# EAGLE design CCM_0020_receiver (EAGLE 9.4.2)

## Sheet 1 of 2: receiver
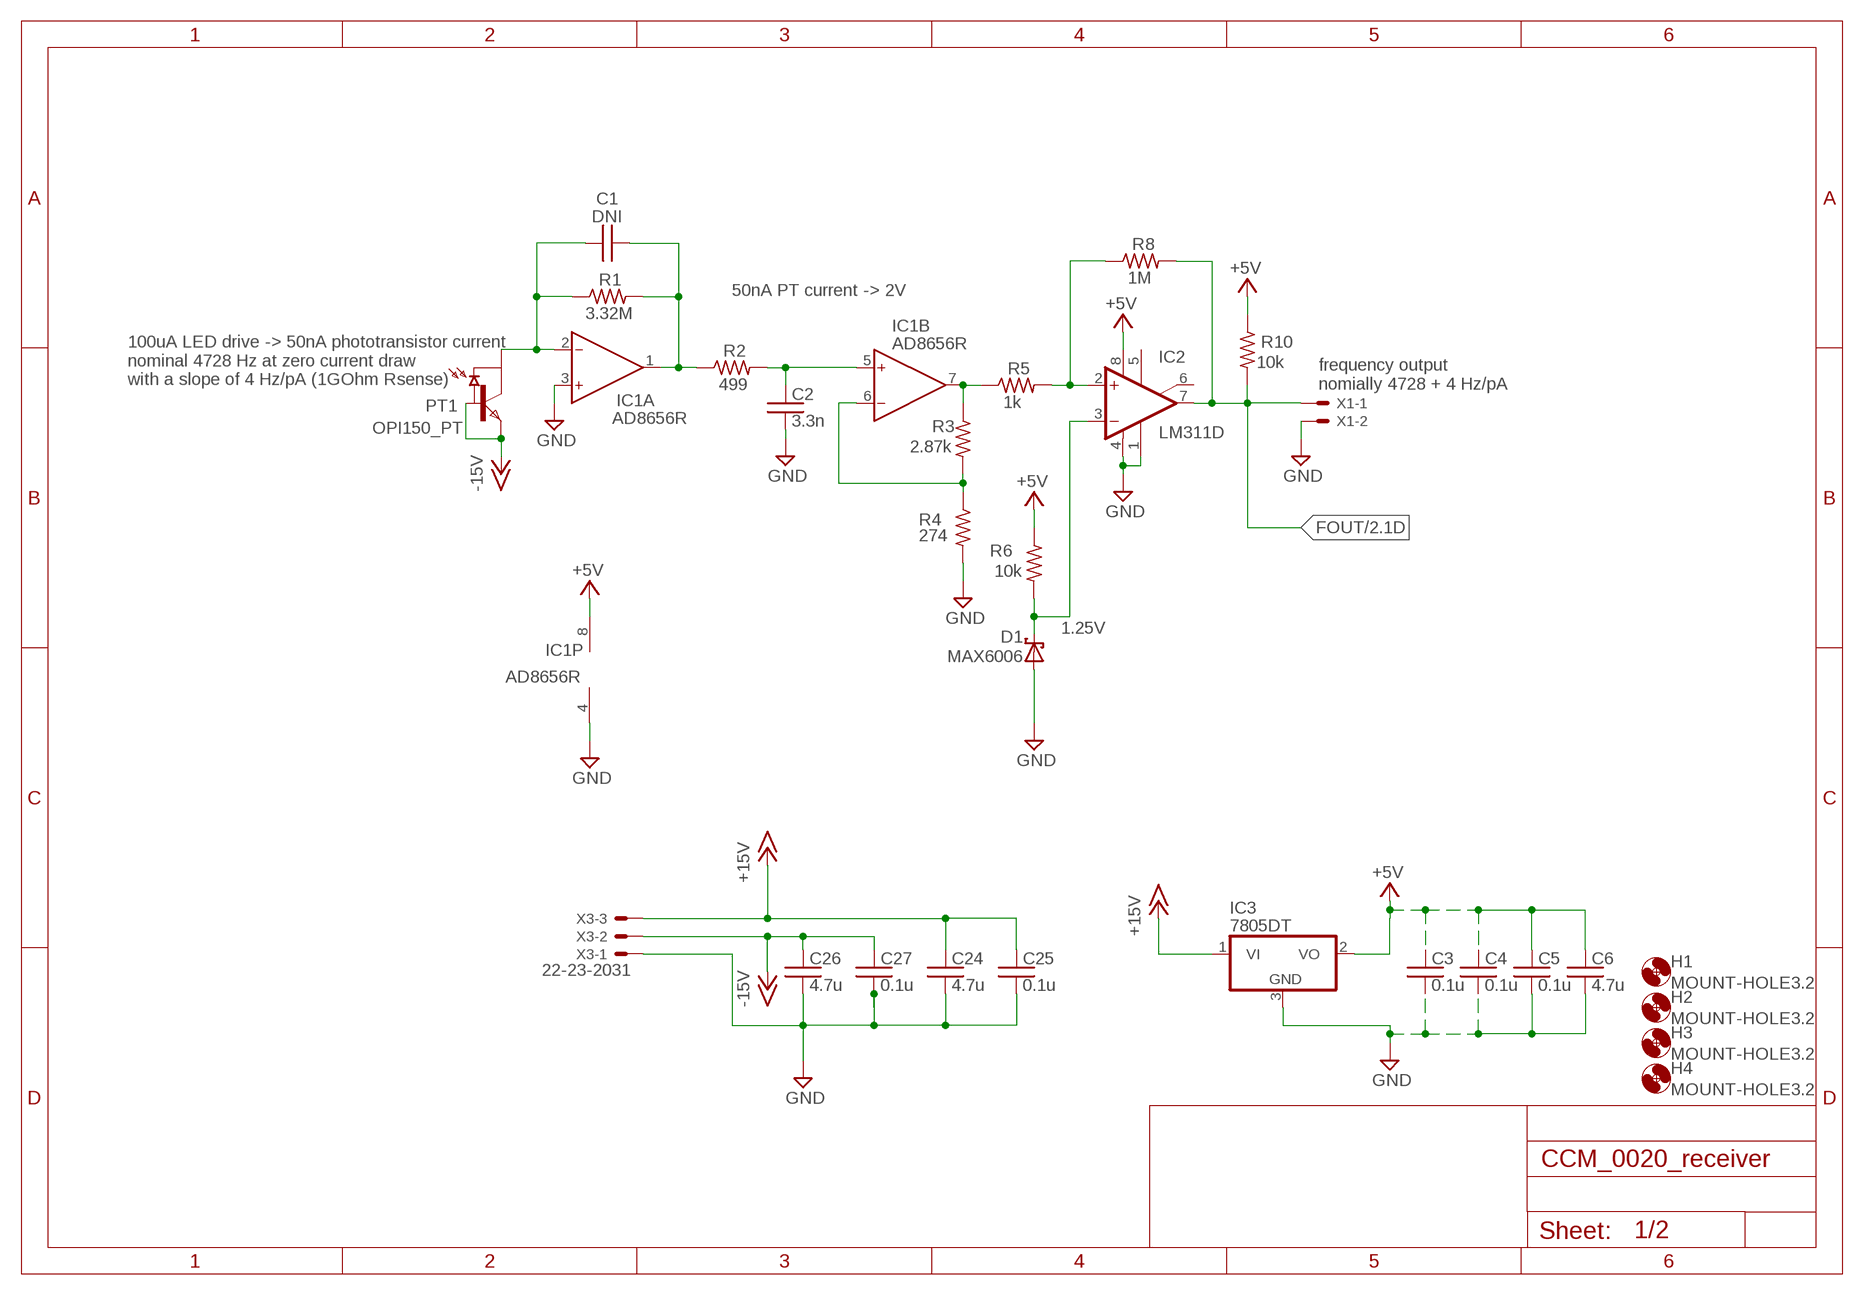
[diagram p0: schematic, sheet 1]

### Parts
C1  DNI  C0603  [0603]
C2  3.3n  C0603  [0603]
C3  0.1u  C0603  [0603]
C4  0.1u  C0603  [0603]
C5  0.1u  C0603  [0603]
C6  4.7u  C0603  [0603]
C24  4.7u  C0603  [0603]
C25  0.1u  C0603  [0603]
C26  4.7u  C0603  [0603]
C27  0.1u  C0603  [0603]
D1  MAX6006  LM4040  [SOT23]
H1  MOUNT-HOLE3.2  [3,2]
H2  MOUNT-HOLE3.2  [3,2]
H3  MOUNT-HOLE3.2  [3,2]
H4  MOUNT-HOLE3.2  [3,2]
IC1  AD8656R  [SO8]
IC2  LM311D  [SO08]
IC3  7805DT  [TO252]
PT1  OPI150_PT  OPI150_PHOTOTRANSISTOR  [OPI150_PHOTOTRANSISTOR]
R1  3.32M  R0603  [0603]
R2  499  R0603  [0603]
R3  2.87k  R0603  [0603]
R4  274  R0603  [0603]
R5  1k  R0603  [0603]
R6  10k  R0603  [0603]
R8  1M  R0603  [0603]
R10  10k  R0603  [0603]
X1  22-23-2021  [22-23-2021]
X3  22-23-2031  [22-23-2031]

### Nets
+15V: C24.1 C25.1 IC3.1(VI) X3.3 ; also sheet 2
-15V: C26.1 C27.1 PT1.P4(BASE) PT1.P5(EMITTER) X3.2 ; also sheet 2
FOUT: IC2.7(OUT) R8.2 R10.2 X1.1 ; also sheet 2
GND: C2.2 C3.2 C4.2 C5.2 C6.2 C24.2 C25.2 C26.2 C27.2 D1.2(A) IC1.3(A:IN+) IC1.4(P:V-) IC2.1(GND) IC2.4(V-) IC3.3(GND) R4.2 X1.2 X3.1 ; also sheet 2
N$2: C1.1 IC1.2(A:IN-) PT1.P3(COLLECTOR) R1.1
N$3: C2.1 IC1.5(B:IN+) R2.2
N$4: C1.2 IC1.1(A:OUT) R1.2 R2.1
N$5: IC1.6(B:IN-) R3.2 R4.1
N$6: IC1.7(B:OUT) R3.1 R5.1
N$8: IC2.2(+IN) R5.2 R8.1
N$14: D1.1(C) IC2.3(-IN) R6.2
VCC: C3.1 C4.1 C5.1 C6.1 IC1.8(P:V+) IC2.8(V+) IC3.2(VO) R6.1 R10.1 ; supply symbol labelled +5V ; also sheet 2
Unconnected: IC2.5(ON) IC2.6(ON/STR)

### Notes on the sheet
- 50nA PT current -> 2V
- 100uA LED drive -> 50nA phototransistor current
  nominal 4728 Hz at zero current draw
  with a slope of 4 Hz/pA (1GOhm Rsense)
- frequency output
  nomially 4728 + 4 Hz/pA
- 1.25V

## Sheet 2 of 2: frequency to voltage
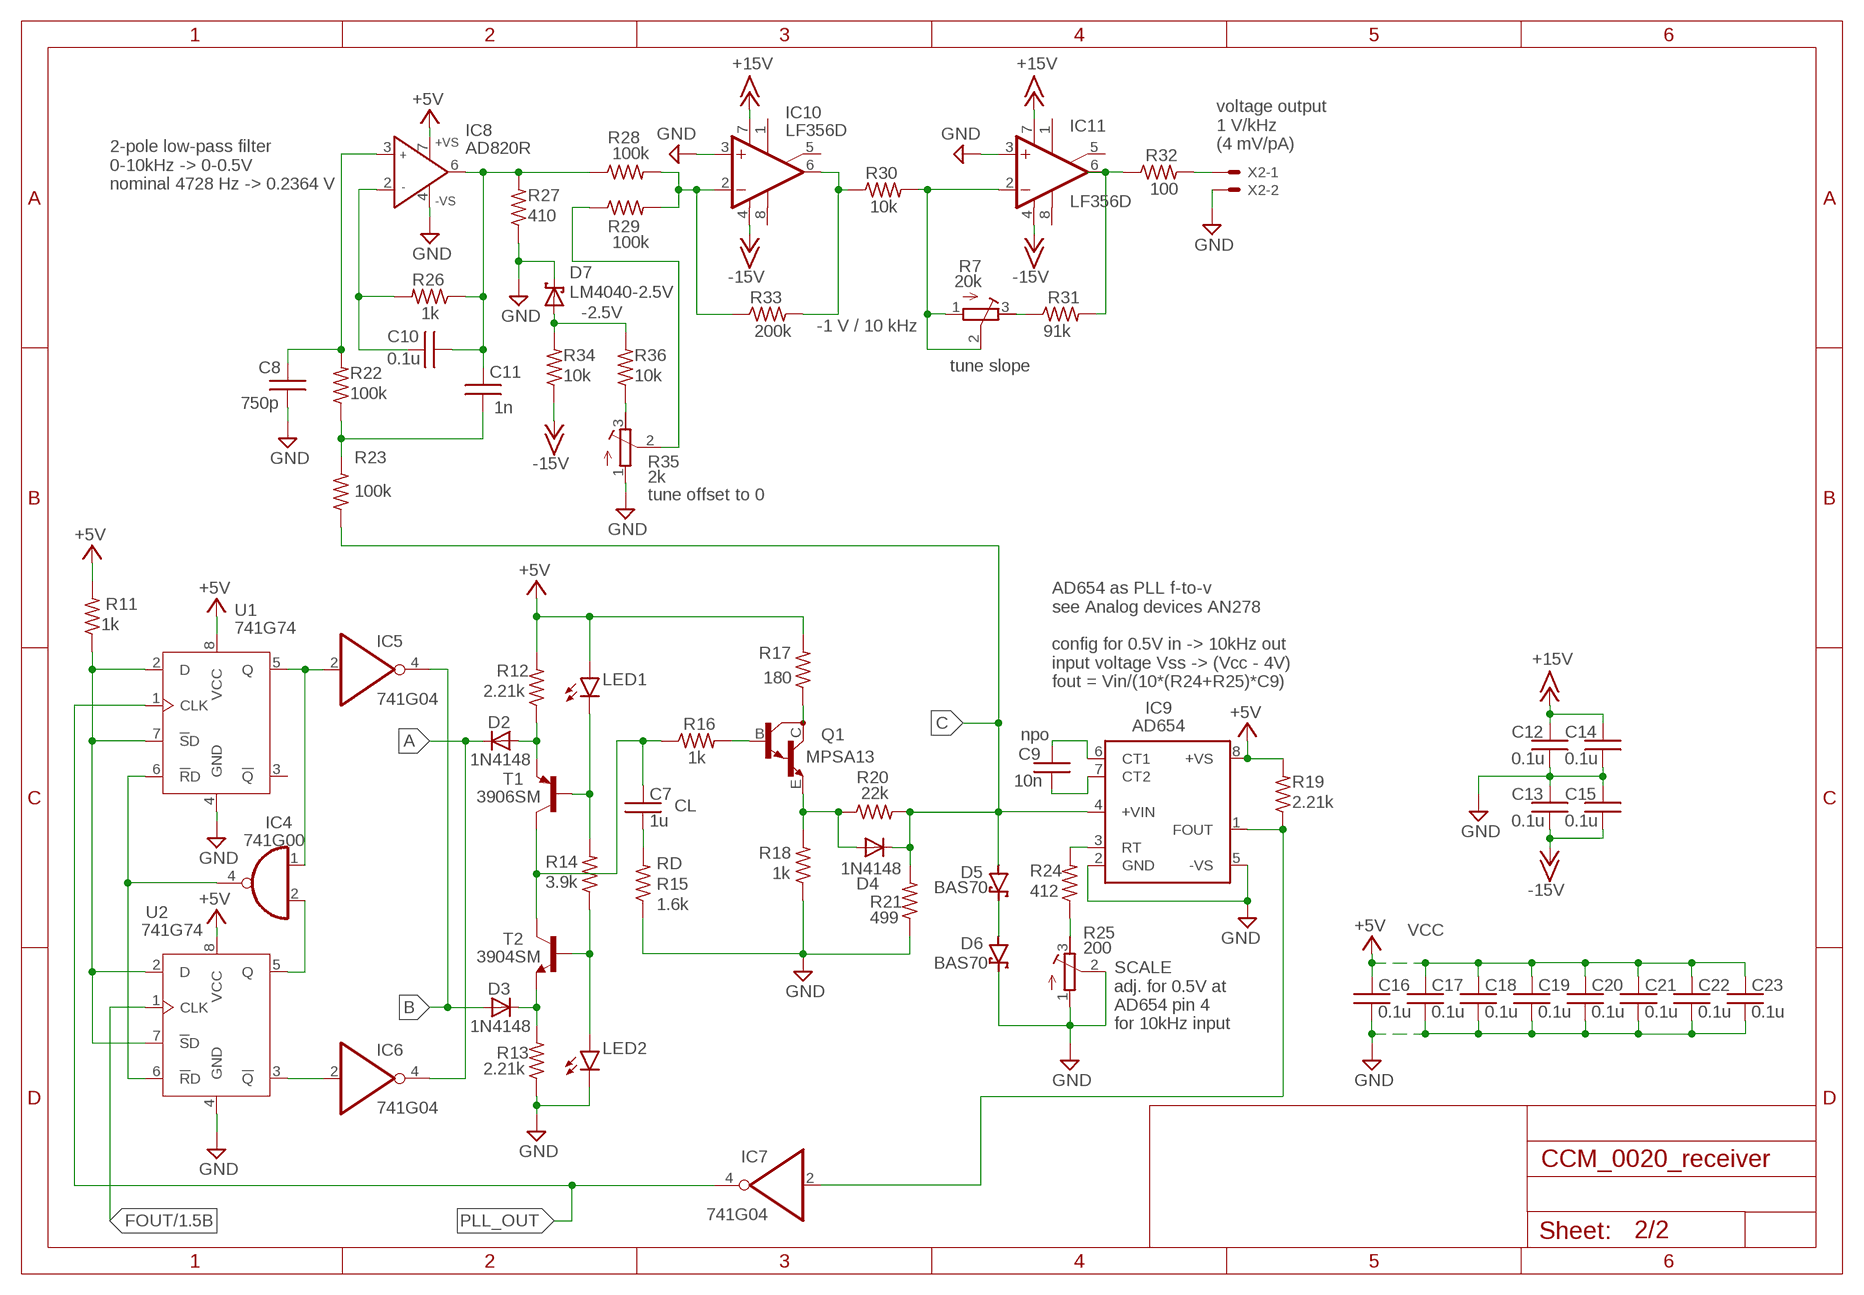
[diagram p1: schematic, sheet 2]

### Parts
C7  1u  C0603  [0603]
C8  750p  C0603  [0603]
C9  10n  C0603  [0603]
C10  0.1u  C0603  [0603]
C11  1n  C0603  [0603]
C12  0.1u  C0603  [0603]
C13  0.1u  C0603  [0603]
C14  0.1u  C0603  [0603]
C15  0.1u  C0603  [0603]
C16  0.1u  C0603  [0603]
C17  0.1u  C0603  [0603]
C18  0.1u  C0603  [0603]
C19  0.1u  C0603  [0603]
C20  0.1u  C0603  [0603]
C21  0.1u  C0603  [0603]
C22  0.1u  C0603  [0603]
C23  0.1u  C0603  [0603]
D2  1N4148  [SOD323_ST]
D3  1N4148  [SOD323_ST]
D4  1N4148  [SOD323_ST]
D5  BAS70  [SOT23]
D6  BAS70  [SOT23]
D7  LM4040-2.5V  LM4040  [SOT23]
IC4  741G00  74AHC1G00DBV  [SOT23-5]
IC5  741G04  74AHC1G04DBV  [SOT23-5]
IC6  741G04  74AHC1G04DBV  [SOT23-5]
IC7  741G04  74AHC1G04DBV  [SOT23-5]
IC8  AD820R  [SO8]
IC9  AD654  [SO08]
IC10  LF356D  [SO08]
IC11  LF356D  [SO08]
LED1  LEDCHIP-LED0603  [CHIP-LED0603]
LED2  LEDCHIP-LED0603  [CHIP-LED0603]
Q1  MPSA13  MMBTA13LT1  [SOT23-BEC]
R7  20k  R-TRIMM64Y  [RTRIM64Y]
R11  1k  R0603  [0603]
R12  2.21k  R0603  [0603]
R13  2.21k  R0603  [0603]
R14  3.9k  R0603  [0603]
R15  1.6k  R0603  [0603]
R16  1k  R0603  [0603]
R17  180  R0603  [0603]
R18  1k  R0603  [0603]
R19  2.21k  R0603  [0603]
R20  22k  R0603  [0603]
R21  499  R0603  [0603]
R22  100k  R0603  [0603]
R23  100k  R0603  [0603]
R24  412  R0603  [0603]
R25  200  R-TRIMM64Y  [RTRIM64Y]
R26  1k  R0603  [0603]
R27  410  R0603  [0603]
R28  100k  R0603  [0603]
R29  100k  R0603  [0603]
R30  10k  R0603  [0603]
R31  91k  R0603  [0603]
R32  100  R0603  [0603]
R33  200k  R0603  [0603]
R34  10k  R0603  [0603]
R35  2k  R-TRIMM64Y  [RTRIM64Y]
R36  10k  R0603  [0603]
T1  3906SM  MMBT3906LT1-PNP-SOT23-BEC  [SOT23-BEC]
T2  3904SM  [SOT23]
U1  741G74  [TSSOP8]
U2  741G74  [TSSOP8]
X2  22-23-2021  [22-23-2021]

### Nets
+15V: C12.2 C14.2 IC10.7(V+) IC11.7(V+) ; also sheet 1
-15V: C13.1 C15.1 IC10.4(V-) IC11.4(V-) R34.1 ; also sheet 1
A: D2.C IC6.4(O)
B: D3.A IC5.4(O)
C: D4.C D5.1(A) IC9.4(+VIN) R20.2 R21.2 R23.1
FOUT: U2.1(CLK) ; also sheet 1
GND: C8.1 C12.1 C13.2 C14.1 C15.2 C16.2 C17.2 C18.2 C19.2 C20.2 C21.2 C22.2 C23.2 D6.3(C) D7.1(C) IC8.4(-VS) IC9.2(GND) IC9.5(-VS) IC10.3(+IN) IC11.3(+IN) LED2.C R13.1 R15.1 R18.1 R21.1 R25.1(A) R25.2(S) R27.1 R35.1(A) U1.4(GND) U2.4(GND) X2.2 ; also sheet 1
N$1: C9.1 IC9.6(CT1)
N$7: IC4.4(O) U1.6(!R!D) U2.6(!R!D)
N$9: R7.3(E) R31.1
N$10: IC4.2(I1) U2.5(Q)
N$11: R11.1 U1.2(D) U1.7(!S!D) U2.2(D) U2.7(!S!D)
N$12: IC6.2(I) U2.3(!Q)
N$13: C11.1 R22.1 R23.2
N$15: IC4.1(I0) IC5.2(I) U1.5(Q)
N$16: C8.2 IC8.3(IN+) R22.2
N$17: C9.2 IC9.7(CT2)
N$18: R24.1 R25.3(E)
N$19: D5.3(C) D6.1(A)
N$20: C7.1 R16.1 T1.C T2.3(C)
N$21: D3.C R13.2 T2.2(E)
N$23: LED1.C R14.2 T1.B
N$24: LED2.A R14.1 T2.1(B)
N$25: C7.2 R15.2
N$26: Q1.C R17.1
N$27: Q1.B R16.2
N$28: D4.A Q1.E R18.2 R20.1
N$29: IC9.3(RT) R24.2
N$30: IC7.2(I) IC9.1(FOUT) R19.1
N$31: C10.2 C11.2 IC8.6(OUT) R26.1 R27.2 R28.1
N$32: C10.1 IC8.2(IN-) R26.2
N$33: IC10.2(-IN) R28.2 R29.2 R33.1
N$34: IC11.6(OUT) R31.2 R32.1
N$35: IC11.2(-IN) R7.1(A) R7.2(S) R30.2
N$36: R32.2 X2.1
N$37: IC10.6(OUT) R30.1 R33.2
N$38: D7.2(A) R34.2 R36.2
N$39: R29.1 R35.2(S)
N$40: R35.3(E) R36.1
N$41: D2.A R12.1 T1.E
PLL_OUT: IC7.4(O) U1.1(CLK)
VCC: C16.1 C17.1 C18.1 C19.1 C20.1 C21.1 C22.1 C23.1 IC8.7(+VS) IC9.8(+VS) LED1.A R11.2 R12.2 R17.2 R19.2 U1.8(VCC) U2.8(VCC) ; supply symbol labelled +5V ; also sheet 1
Unconnected: IC10.1(ON1) IC10.5(ON2) IC10.8(OPT) IC11.1(ON1) IC11.5(ON2) IC11.8(OPT) U1.3(!Q)

### Notes on the sheet
- voltage output
  1 V/kHz
  (4 mV/pA)
- 2-pole low-pass filter
  0-10kHz -> 0-0.5V
  nominal 4728 Hz -> 0.2364 V
- -2.5V
- -1 V / 10 kHz
- tune slope
- tune offset to 0
- AD654 as PLL f-to-v
  see Analog devices AN278
  
  config for 0.5V in -> 10kHz out
  input voltage Vss -> (Vcc - 4V)
  fout = Vin/(10*(R24+R25)*C9)
- npo
- CL
- RD
- SCALE
  adj. for 0.5V at 
  AD654 pin 4
  for 10kHz input

## Power pins joined to a net without a drawn wire
GND: IC4.3(GND) IC5.3(GND) IC6.3(GND) IC7.3(GND)
VCC: IC4.5(VCC) IC5.5(VCC) IC6.5(VCC) IC7.5(VCC)

## Library data of the parts
C1-C27 = acrooptics:C: Capacitor
D1 D7 = noah:LM4040: LM4040 Reference Zener Diode
D2-D4 = custom_parts:1N4148: DIODE high speed (Philips)
D5 D6 = diode:BAS70: Silicon Schottky Diodes General-purpose diode for high-speed switching
H1-H4 = holes:MOUNT-HOLE: MOUNTING HOLE with drill center marker
IC1 = analog-devices:AD8656: Low Noise, Precision CMOS Amplifier Source: http://www.analog.com/static/imported-files/data_sheets/AD8655_8656.pdf; MPN: AD8656ARZ; OC_FARNELL: 1117887; OC_NEWARK: 19M0993
IC2 = linear:LM311: COMPARATOR
IC3 = linear:78*: Positive VOLTAGE REGULATOR Source: http://cache.national.com/ds/LM/LM78L05.pdf http://www.fairchildsemi.com/ds/LM/LM7805.pdf
IC4 = 74xx-little-de:74*1G00: 2-input NAND gate
IC5-IC7 = 74xx-little-de:74*1G04: INVERTER Gate
IC8 = analog-devices:AD820: Single-Supply, Rail-to-Rail, Low Power, FET Input Op Amp Source: http://www.analog.com/static/imported-files/data_sheets/AD820.pdf; OC_FARNELL: 1838867; OC_NEWARK: unknown
IC9 = noah:AD654: Low Cost Monolithic Voltage-to-Frequency Converter
IC10 IC11 = linear:LF356: OP AMP
LED1 LED2 = led:LED: LED OSRAM: - CHIPLED LG R971, LG N971, LY N971, LG Q971, LY Q971, LO R971, LY R971 LH N974, LH R974 LS Q976, LO Q976, LY Q976 LO Q996 - Hyper CHIPLED LW Q18S LB Q993, LB Q99A, LB R99A - SideLED LS A670, LO A670, LY A670, LG A670, LP A670 LB A673, LV A673, LT A673, LW A673 LH A674 LY A675 LS A676, LA A676, LO A676, LY A676, LW A676 LS A679, LY A679, LG A679 - Hyper Micro SIDELED® LS Y876, LA Y876, LO Y876, LY Y876 LT Y87S - SmartLED LW L88C, LW L88S LB L89C, LB L89S, LG L890 LS L89K, LO L89K, LY L89K LS L896, LA L896, LO L896, LY L896 - TOPLED LS T670, LO T670, LY T670, LG T670, LP T670 LSG T670, LSP T670, LSY T670, LOP T670, LYG T670 LG T671, LOG T671, LSG T671 LB T673, LV T673, LT T673, LW T673 LH T674 LS T676, LA T676, LO T676, LY T676, LB T676, LH T676, LSB T676, LW T676 LB T67C, LV T67C, LT T67C, LS T67K, LO T67K, LY T67K, LW E67C LS E67B, LA E67B, LO E67B, LY E67B, LB E67C, LV E67C, LT E67C LW T67C LS T679, LY T679, LG T679 LS T770, LO T770, LY T770, LG T770, LP T770 LB T773, LV T773, LT T773, LW T773 LH T774 LS E675, LA E675, LY E675, LS T675 LS T776, LA T776, LO T776, LY T776, LB T776 LHGB T686 LT T68C, LB T68C - Hyper Mini TOPLED® LB M676 - Mini TOPLED Santana® LG M470 LS M47K, LO M47K, LY M47K Source: http://www.osram.convergy.de LUXEON: - LUMILED® LXK2-PW12-R00, LXK2-PW12-S00, LXK2-PW14-U00, LXK2-PW14-V00 LXK2-PM12-R00, LXK2-PM12-S00, LXK2-PM14-U00 LXK2-PE12-Q00, LXK2-PE12-R00, LXK2-PE12-S00, LXK2-PE14-T00, LXK2-PE14-U00 LXK2-PB12-K00, LXK2-PB12-L00, LXK2-PB12-M00, LXK2-PB14-N00, LXK2-PB14-P00, LXK2-PB14-Q00 LXK2-PR12-L00, LXK2-PR12-M00, LXK2-PR14-Q00, LXK2-PR14-R00 LXK2-PD12-Q00, LXK2-PD12-R00, LXK2-PD12-S00 LXK2-PH12-R00, LXK2-PH12-S00 LXK2-PL12-P00, LXK2-PL12-Q00, LXK2-PL12-R00 Source: www.luxeon.com KINGBRIGHT: KA-3528ASYC Source: www.kingbright.com
PT1 = noah:OPI150_PHOTOTRANSISTOR
Q1 = transistor-npn:MMBTA13*: NPN Darlington Transistor
R1-R6 R8 R10-R24 R26-R34 R36 = acrooptics:R: 0603 resistor
R7 R25 R35 = rcl:R-TRIMM: Trimm resistor; SPICEMODEL: X; SPICEPREFIXL: POT
T1 = transistor:*-PNP-: PNP Transistror
T2 = noah:3904: NPN TRANSISTOR
U1 U2 = noah:74*1G74
X1 X2 = con-molex:22-23-2021: .100" (2.54mm) Center Header - 2 Pin; MF: MOLEX; MPN: 22-23-2021; OC_FARNELL: 1462926; OC_NEWARK: 25C3832
X3 = con-molex:22-23-2031: .100" (2.54mm) Center Header - 3 Pin; MF: MOLEX; MPN: 22-23-2031; OC_FARNELL: 1462950; OC_NEWARK: 30C0862

## Net classes
1 standard: width 0.61 mm, clearance 0.254 mm

## Board
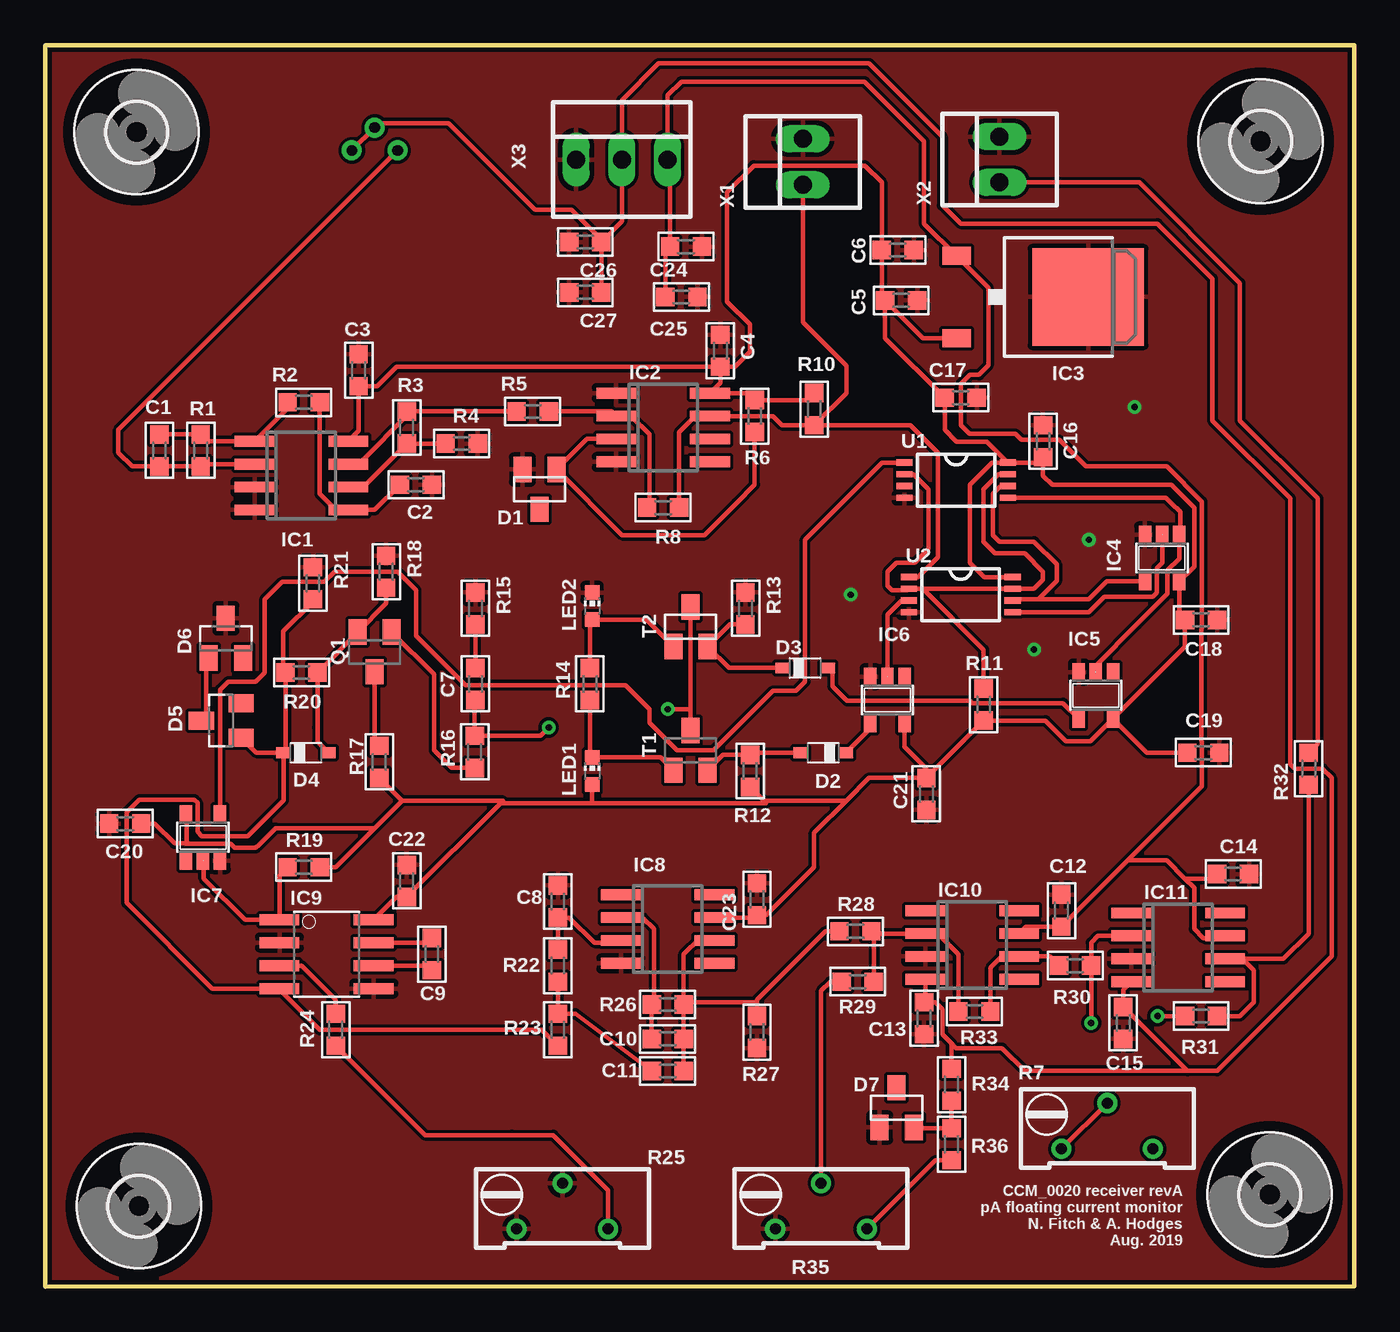
[diagram p2: board, top side]
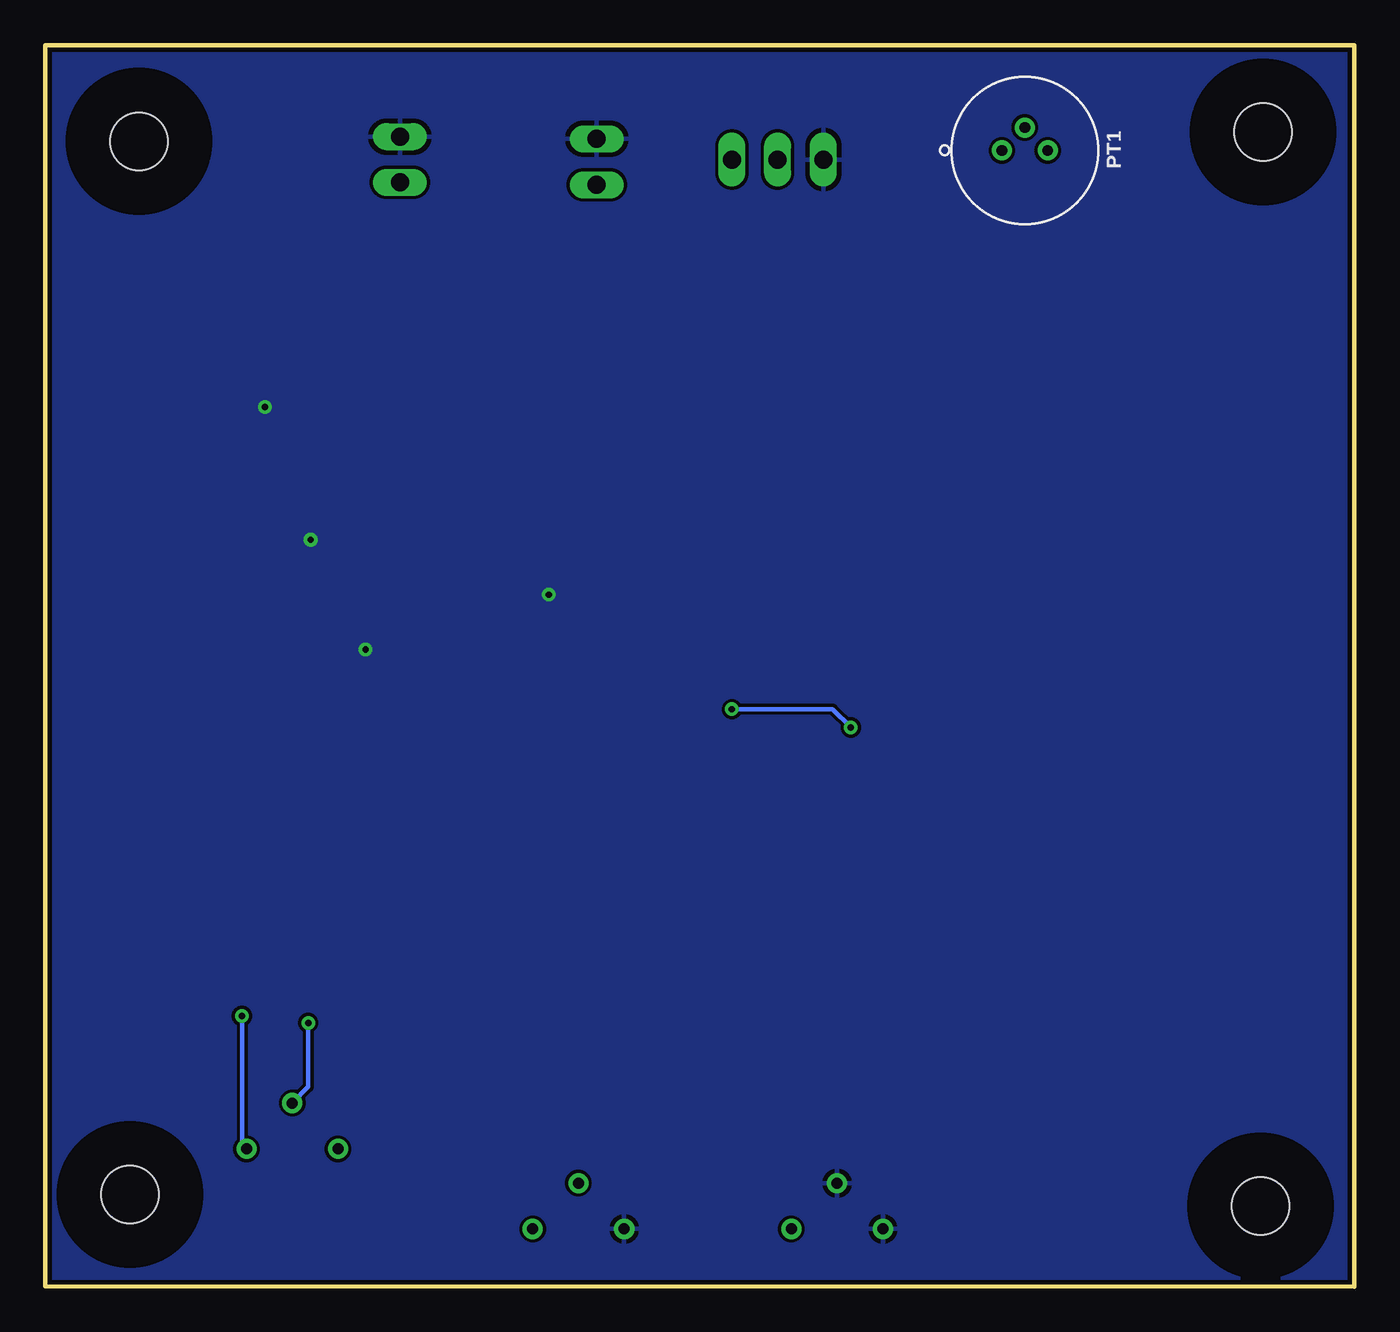
[diagram p3: board, bottom side, seen from below]

Size 72.64 x 68.86 mm. Coordinates in mm from the lower left corner, seen from the top.
Outline: 0,0 72.64,0.03 72.64,68.86 0,68.86 0,0
Copper layers (1*16): Top 0.035mm / dielectric 1.5mm / Bottom 0.035mm
Design rules "default *": minimum track width 10mil, minimum drill 10mil, track to track 7mil, track to pad 7mil, pad to pad 7mil, via to via 7mil, smd to smd 7mil, copper to edge 10mil, drill to drill 8mil, minimum pad ring 10mil, minimum via ring 8mil, stop-mask expansion 4mil, vias tented up to drill 0mil, thermal gap 10mil

### Footprints (pad centres in the part's own frame; a part is rotated, then mirrored left to right if it is on the bottom)
0603 = smd 1.016 x 1.016: 1 -0.889,0; 2 0.889,0
SOT23 = smd 1 x 1.4: 1 -0.95,-1.1; 2 0.95,-1.1; 3 0,1.1
SOD323_ST = smd 0.8 x 0.6: A 1.25,0; C -1.25,0
3,2 = hole 3.2: 0,0
SO8 = smd 0.6 x 2.2: 1 -1.905,-2.6; 2 -0.635,-2.6; 3 0.635,-2.6; 4 1.905,-2.6; 5 1.905,2.6; 6 0.635,2.6; 7 -0.635,2.6; 8 -1.905,2.6
SO08 = smd 0.6 x 2.2: 1 -1.905,-2.6; 2 -0.635,-2.6; 3 0.635,-2.6; 4 1.905,-2.6; 5 1.905,2.6; 6 0.635,2.6; 7 -0.635,2.6; 8 -1.905,2.6
TO252 = smd 1 x 1.6: 1 -2.28,-4.8; 2 2.28,-4.8 | smd 5.4 x 6.2: 3 0,2.5
SOT23-5 = smd 0.69 x 0.99: 1 -0.95,-1.29; 2 0,-1.29; 3 0.95,-1.29; 4 0.95,1.3; 5 -0.95,1.3
SO08' = smd 0.61 x 2.21: 1 -1.905,-2.616; 2 -0.635,-2.616; 3 0.635,-2.616; 4 1.905,-2.616; 5 1.905,2.616; 6 0.635,2.616; 7 -0.635,2.616; 8 -1.905,2.616
CHIP-LED0603 = smd 0.8 x 0.8: A 0,-0.75; C 0,0.75
OPI150_PHOTOTRANSISTOR = drill 0.6: P3 0,1.27; P4 1.27,0; P5 0,-1.27
SOT23-BEC = smd 1 x 1.4: B -0.95,-1.1; C 0,1.1; E 0.95,-1.1
RTRIM64Y = drill 0.61: 1 0,-2.54; 2 -2.54,0; 3 0,2.54
TSSOP8 = smd 0.9 x 0.35: 1 -2.875,0.975; 2 -2.875,0.325; 3 -2.875,-0.325; 4 -2.875,-0.975; 5 2.875,-0.975; 6 2.875,-0.325; 7 2.875,0.325; 8 2.875,0.975
22-23-2021 = drill 1 long: 1 -1.27,0; 2 1.27,0
22-23-2031 = drill 1 long: 1 -2.54,0; 2 0,0; 3 2.54,0

### Placement (x,y rotation side)
C1  6.35,46.38 90 top
C2  20.57,44.48 0 top
C3  17.4,50.83 90 top
C4  37.47,51.9 90 top
C5  47.5,54.7 0 top
C6  47.31,57.49 0 top
C7  23.88,33.43 90 top
C8  28.45,21.36 270 top
C9  21.46,18.44 90 top
C10  34.54,13.74 0 top
C11  34.54,11.96 0 top
C12  56.39,20.85 270 top
C13  48.77,14.88 270 top
C14  65.91,22.89 180 top
C15  59.82,14.63 270 top
C16  55.37,46.89 90 top
C17  50.8,49.3 0 top
C18  64.14,36.98 0 top
C19  64.26,29.62 0 top
C20  4.45,25.68 180 top
C21  48.9,27.33 270 top
C22  20.07,22.5 90 top
C23  39.5,21.49 90 top
C24  35.56,57.68 0 top
C25  35.31,54.89 0 top
C26  29.97,57.94 180 top
C27  29.97,55.14 180 top
D1  27.43,44.22 180 top
D2  43.18,29.62 180 top
D3  42.16,34.32 0 top
D4  14.48,29.62 0 top
D5  9.78,31.39 90 top
D6  10.03,35.97 0 top
D7  47.24,9.93 0 top
H1  5.21,4.47 0 top
H2  67.94,5.11 0 top
H3  5.08,64.03 0 top
H4  67.44,63.53 0 top
IC1  14.22,44.98 270 top
IC2  34.29,47.65 270 top
IC3  55.37,54.89 270 top
IC4  61.98,40.41 180 top
IC5  58.29,32.79 180 top
IC6  46.74,32.54 180 top
IC7  8.76,24.92 0 top
IC8  34.54,19.84 270 top
IC9  AD654  [SO08']  15.62,18.44 270 top
IC10  51.44,18.95 270 top
IC11  62.87,18.82 270 top
LED1  30.35,28.6 0 top
LED2  30.35,37.74 0 top
PT1  18.29,63.02 90 bottom
Q1  18.29,35.2 180 top
R1  8.64,46.38 90 top
R2  14.35,49.05 0 top
R3  20.07,47.65 270 top
R4  23.11,46.76 0 top
R5  27.05,48.54 0 top
R6  39.37,48.29 270 top
R7  58.93,7.65 270 top
R8  34.29,43.21 0 top
R10  42.67,48.67 270 top
R11  52.07,32.28 270 top
R12  39.12,28.6 270 top
R13  38.86,37.62 270 top
R14  30.23,33.43 270 top
R15  23.88,37.62 270 top
R16  23.84,29.66 270 top
R17  18.54,29.11 270 top
R18  18.92,39.65 270 top
R19  14.35,23.27 0 top
R20  14.22,34.06 180 top
R21  14.86,39.01 270 top
R22  28.45,17.81 90 top
R23  28.45,14.25 90 top
R24  16.13,14.25 90 top
R25  28.7,3.2 270 top
R26  34.54,15.65 180 top
R27  39.5,14.12 90 top
R28  44.96,19.71 0 top
R29  45.09,16.92 0 top
R30  57.15,17.81 0 top
R31  64.14,15.01 0 top
R32  70.1,28.73 90 top
R33  51.56,15.27 0 top
R34  50.29,11.2 270 top
R35  43.05,3.2 270 top
R36  50.29,7.9 90 top
T1  35.81,29.74 0 top
T2  35.81,36.6 0 top
U1  50.55,44.73 0 top
U2  50.8,38.38 0 top
X1  42.04,62.38 90 top
X2  52.96,62.51 90 top
X3  32,62.51 0 top

### Tracks (layer width: path | path; a pad name or v marks a point on that pad's centre or on a via)
+15V
  Top 0.254: 60.07,23.65 62.23,23.65 63.25,22.63 | 60.07,23.65 C12.2 54.42,19.96 IC10.7 | 63.25,22.63 64.77,22.63 C14.2 | 63.25,22.63 63.75,22.12 63.75,19.84 64.26,19.33 65.34,19.33 IC11.7 | 60.07,23.65 64.19,27.76 64.19,30.25 64.16,30.28 64.16,36.45 64.19,36.48 64.19,43.54 62.23,45.49 57.73,45.49 56.26,46.96 54.15,46.96 53.82,47.29 51.28,47.29 50.8,47.78 50.8,50.06 51.31,50.57 51.82,50.57 52.33,51.09 52.33,55.41 IC3.1 50.55,57.17 48.77,58.95 48.77,63.53 45.47,66.83 35.31,66.83 34.54,66.07 X3.3 34.67,62.38 C24.1 34.42,57.43 C25.1
-15V
  Top 0.254: C26.1 32,59.08 X3.2 32,65.81 34.04,67.84 45.72,67.84 49.78,63.78 49.78,59.97 50.8,58.95 61.72,58.95 64.77,55.91 64.77,48.03 69.09,43.71 69.09,28.98 69.34,28.73 70.87,28.73 71.37,28.22 71.37,18.31 65.02,11.96 63.37,11.96 | C26.1 C27.1 | 63.37,11.96 54.36,11.96 53.09,13.23 50.55,13.23 50.29,13.49 | 50.29,12.22 R34.1 50.29,13.49 | IC10.4 48.84,15.84 C13.1 49.4,15.77 49.78,15.39 49.78,14 50.29,13.49 | 63.37,11.96 C15.1 59.82,16.47 IC11.4 | C26.1 30.86,58.06 29.21,59.72 27.18,59.72 22.38,64.52 18.52,64.52 PT1.P4 PT1.P5
A
  Top 0.254: D2.C 45.79,30.97 IC6.4
B
  Top 0.254: D3.A 43.69,34.04 43.69,33.3 44.5,32.49 51.31,32.49 51.44,32.36 56.48,32.36 IC5.4
C
  Top 0.254: R23.1 27.56,14.25 15.24,14.25 12.95,16.54 IC9.4 9.27,16.54 4.52,21.29 4.52,26.31 5.22,27.02 8.28,27.02 8.46,26.84 8.46,25.22 8.69,24.99 11.24,24.99 13.23,26.97 D4.C | D5.1 11.71,29.62 D4.C | R20.2 13.34,33.81 | 13.34,33.81 13.34,29.72 D4.C | R21.2 14.86,38 13.21,36.35 13.21,33.93 13.34,33.81
FOUT
  Top 0.254: X1.1 42.04,53.49 43.69,51.84 44.45,51.08 44.45,49.56 R10.2 | R8.2 35.18,47.4 36.07,48.29 IC2.7 40.39,48.29 40.89,47.78 R10.2 | U2.1 48.43,39.35 49.53,40.45 49.53,40.67 49.53,46.25 48.01,47.78 R10.2
GND  (via drill 0.35)
  other vias: 44.7,38.38 54.86,35.33 57.91,41.43 60.45,48.79
  pour Top: 0,0.03 72.64,0.03 72.64,68.86 0,68.86
  pour Bottom: 0,0.03 0,68.86 72.64,68.86 72.64,0.03
N$1
  Top 0.254: IC9.6 21.21,17.81 C9.1
N$2
  Top 0.254: IC1.2 8.76,45.62 R1.1 C1.1 4.83,45.49 4.06,46.25 4.06,47.52 PT1.P3
N$3
  Top 0.254: C2.1 18.29,43.08 IC1.5 16.13,43.08 15.24,43.97 R2.2
N$4
  Top 0.254: C1.2 R1.2 9.02,46.89 IC1.1 13.46,48.73 R2.1
N$5
  Top 0.254: R4.1 R3.2 17.65,44.35 IC1.6
N$6
  Top 0.254: R3.1 20.32,48.54 | 20.32,48.54 R5.1 | IC1.7 17.4,45.62 20.32,48.54
N$7
  Top 0.254: IC4.4 58.9,39.11 57.91,38.13 55.12,38.13 | 55.12,38.13 53.75,38.13 U2.6 | U1.6 53.02,44.4 52.58,43.97 52.58,41.68 52.93,41.33 54.86,41.33 56.13,40.06 56.13,39.14 55.12,38.13
N$8
  Top 0.254: R8.1 33.53,43.33 33.53,47.27 32.51,48.29 IC2.2 31.44,48.54 R5.2
N$9  (via drill 0.35)
  Top 0.254: R31.1 v61.72,15.01
  Bottom 0.254: v61.72,15.01 61.72,7.9 R7.3
N$10
  Top 0.254: U2.5 57.91,37.4 58.78,38.27 61.46,38.27 61.68,38.49 61.68,38.63 61.68,39.86 61.98,40.16 IC4.2
N$11
  Top 0.254: U2.2 50.04,38.7 U2.7 54.86,38.7 55.37,39.21 55.37,39.65 54.36,40.67 52.7,40.67 52.07,41.3 52.07,44.22 52.9,45.05 U1.7 | U2.2 48.7,38.7 52.07,35.33 R11.1 | U2.2 47.85,38.63 46.99,38.63 46.74,38.89 46.74,39.65 47.24,40.16 48.26,40.16 49.02,40.92 49.02,44.22 48.19,45.05 U1.2
N$12
  Top 0.254: IC6.2 46.74,37.27 47.52,38.05 U2.3
N$13
  Top 0.254: C11.1 29.42,15.14 R23.2 R22.1
N$14
  Top 0.254: IC2.3 30.08,47.02 D1.1 32.02,41.68 36.58,41.68 38.35,43.46 39.37,44.48 R6.2
N$15
  Top 0.254: IC5.2 58.29,34.44 60.58,36.73 62.1,38.25 62.28,38.43 62.28,39.73 62.93,40.38 IC4.1 62.97,41.7 62.97,42.97 62.48,43.46 62.19,43.75 54.36,43.75 U1.5
N$16
  Top 0.254: R22.2 C8.2 29.08,20.47 30.48,19.08 31.82,19.08 IC8.3
N$17
  Top 0.254: IC9.7 21.21,19.08 C9.2
N$18
  Top 0.254: R24.1 21.08,8.41 25.91,8.41 28.19,8.41 31.24,5.36 R25.3
N$19
  Top 0.254: D5.3 8.93,31.65 8.93,34.72 D6.1
N$20  (via drill 0.35)
  Top 0.254: C7.1 23.84,32.5 R16.1 27.48,30.55 v27.94,31.01 | T2.3 35.81,32.03 | 35.81,32.03 T1.C | v34.54,32.03 35.81,32.03
  Bottom 0.254: v27.94,31.01 28.96,32.03 v34.54,32.03
N$21
  Top 0.254: D3.C 37.95,34.32 T2.2 37.99,36.73 R13.2
N$23
  Top 0.254: T1.B 34.16,29.35 LED1.C 30.23,29.48 R14.2
N$24
  Top 0.254: R14.1 30.23,36.87 LED2.A 33.37,36.99 T2.1
N$25
  Top 0.254: C7.2 R15.2
N$26
  Top 0.254: Q1.C 18.29,30.25 R17.1
N$27
  Top 0.254: Q1.B 21.59,33.95 21.59,29.74 22.56,28.77 R16.2
N$28
  Top 0.254: D4.A 15.11,30.23 15.11,31.01 R20.1 17.34,36.29 Q1.E 18.92,37.89 R18.2
N$29
  Top 0.254: IC9.3 14.22,17.81 16.13,15.9 R24.2
N$30
  Top 0.254: IC7.2 8.81,23.58 8.81,22.63 11.09,20.35 IC9.1 13.01,22.81 R19.1
N$31
  Top 0.254: R28.1 43.31,19.71 39.5,15.9 R27.2 39.5,15.65 39.37,15.77 35.56,15.77 R26.1 | R26.1 35.43,18.44 36.32,19.33 37.02,19.33 IC8.6 | R26.1 C10.2 C11.2
N$32
  Top 0.254: C10.1 R26.2 33.78,15.77 33.78,19.84 33.15,20.47 IC8.2
N$33
  Top 0.254: R33.1 50.67,18.44 49.53,19.58 IC10.2 45.97,19.58 | R28.2 45.97,19.58 | 45.97,19.58 R29.2
N$34
  Top 0.254: R32.1 70.1,19.58 68.71,18.19 IC11.6 66.42,18.19 67.06,17.55 67.06,15.77 66.29,15.01 R31.2
N$35  (via drill 0.35)
  Top 0.254: R7.2 R7.1 | v58.04,14.63 R30.2 58.04,19.08 58.42,19.46 IC11.2
  Bottom 0.254: v58.04,14.63 58.04,11.07 R7.2
N$36
  Top 0.254: X2.1 60.71,61.24 66.29,55.65 66.29,48.03 70.61,43.71 70.61,43.21 70.61,37.87 70.61,30.12 R32.2
N$37
  Top 0.254: R30.1 55.75,18.31 IC10.6 53.09,18.31 52.45,17.68 R33.2
N$38
  Top 0.254: D7.2 48.24,8.79 R36.2 R34.2
N$39
  Top 0.254: R29.1 43.56,16.92 43.05,16.41 R35.2
N$40
  Top 0.254: R35.3 49.4,7.01 R36.1
N$41
  Top 0.254: T1.E 37.61,29.49 R12.1 39.24,29.62 D2.A
PLL_OUT
  Top 0.254: U1.1 46.44,45.7 42.16,41.43 42.16,33.55 41.66,33.05 40.39,33.05 37.08,29.74 35.05,29.74 33.53,31.27 33.53,32.03 32.21,33.35 23.32,33.35 20.57,36.09 20.57,38.63 19.56,39.65 16.05,39.65 15.49,39.09 13.16,39.09 12.19,38.13 12.19,34.06 11.68,33.55 10.16,33.55 9.71,33.11 IC7.4
VCC
  Top 0.254: IC1.8 17.4,47.46 C3.1 18.41,49.94 19.49,51.02 C4.1 | C4.1 37.47,50.13 IC2.8 38.99,49.56 R6.1 42.29,49.17 R10.1 | C4.1 38.29,51.02 39.12,51.84 39.12,53.37 37.85,54.64 37.85,60.71 39.32,62.18 45.48,62.18 46.42,61.24 C6.1 46.42,54.89 C5.1 | 39.88,26.95 44.45,26.95 | 30.35,26.82 40.01,26.82 39.88,26.95 | 30.35,26.82 25.27,26.82 | 19.81,26.95 25.4,26.95 25.27,26.82 | R17.2 19.81,26.95 | R12.2 39.88,26.95 | LED1.A 30.35,26.82 | IC6.5 47.69,29.93 48.9,28.72 C21.1 | IC8.7 39.37,20.47 C23.1 40.01,20.6 42.67,23.27 42.67,25.17 44.45,26.95 | 25.27,26.82 C22.1 19.51,21.62 IC9.8 | U2.8 52.11,39.35 51.31,40.16 51.31,44.48 52.54,45.7 U1.8 | C20.1 6.09,25.68 7.19,24.59 7.75,24.59 | 7.75,24.59 7.98,24.59 | 7.85,24.55 10.31,24.55 10.53,24.33 11.68,24.33 11.78,24.43 11.8,24.43 12.8,25.43 18.29,25.43 | IC7.5 7.85,26.18 7.85,24.55 | C5.1 46.61,52.6 C17.1 49.91,47.52 50.57,46.86 52.26,46.86 U1.8 | IC3.2 48.7,52.61 C5.1 | C21.1 R11.2 55.5,31.39 56.64,30.25 58,30.25 IC5.5 | IC5.5 63.25,35.49 C18.1 62.93,37.3 IC4.5 63.75,39.94 63.75,43.21 62.48,44.48 55.88,44.48 55.37,44.98 C16.1 55.08,45.7 U1.8 | 44.45,26.95 45.72,28.22 C21.1 | IC5.5 61.12,29.62 C19.1 | R19.2 16.13,23.27 18.29,25.43 | 18.29,25.43 19.81,26.95 | 7.85,24.55 7.78,24.55 7.75,24.59

### Text on the board
tPlace: CCM_0020 receiver revA / pA floating current monitor / N. Fitch & A. Hodges / Aug. 2019